# Altium project PanGu.PrjPcb
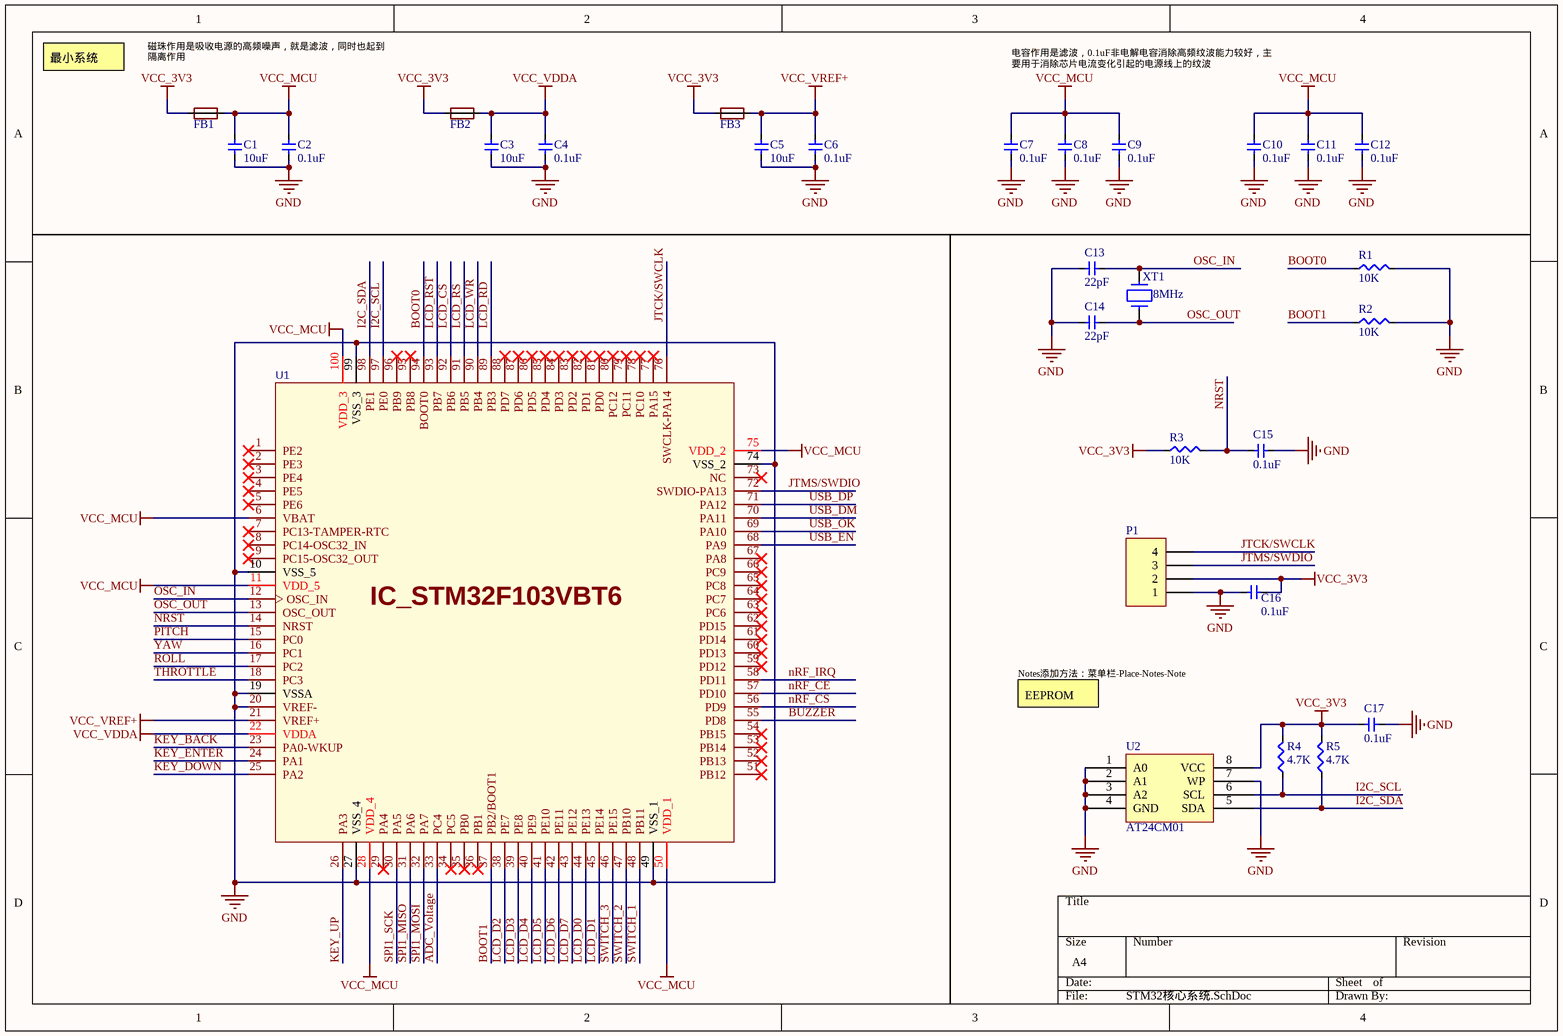
[diagram p0: STM32核心系统.SchDoc]
2 sheets, 86 parts. Net scope: global (net labels, ports and power ports of the same name join across sheets).
Board file: PanGu.PcbDoc
Sheets:
  STM32核心系统.SchDoc
  基本外设.SchDoc

## Sheet STM32核心系统.SchDoc
size A4

### Parts
C1  10uF  [C 0603_L]
C2  0.1uF  [C 0603_L]
C3  10uF  [C 0603_L]
C4  0.1uF  [C 0603_L]
C5  10uF  [C 0603_L]
C6  0.1uF  [C 0603_L]
C7  0.1uF  [C 0603_L]
C8  0.1uF  [C 0603_L]
C9  0.1uF  [C 0603_L]
C10  0.1uF  [C 0603_L]
C11  0.1uF  [C 0603_L]
C12  0.1uF  [C 0603_L]
C13  22pF  [C 0603_L]
C14  22pF  [C 0603_L]
C15  0.1uF  [C 0603_L]
C16  0.1uF  [C 0603_L]
C17  0.1uF  [C 0603_L]
FB1  FB_BEAD  [FB 0603_L]  (value not drawn)
FB2  FB_BEAD  [FB 0603_L]  (value not drawn)
FB3  FB_BEAD  [FB 0603_L]  (value not drawn)
P1  Header 4  [XH2.54-WI-4P]  (value not drawn)
R1  10K  [R 0603_L]
R2  10K  [R 0603_L]
R3  10K  [R 0603_L]
R4  4.7K  [R 0603_L]
R5  4.7K  [R 0603_L]
U1  IC_STM32F103VBT6  [LQFP100 14x14_M]
U2  AT24CM01  [SOIC-8]
XT1  value 8MHz  [OSC 5032-2P]  (hidden comment: XT_CRYSTAL2P)

### Nets
GND: C1.2 C2.2 C3.2 C4.2 C5.2 C6.2 C7.2 C8.2 C9.2 C10.2 C11.2 C12.2 C13.1 C14.1 C15.2 C16.1 C17.2 P1.1 R1.2 R2.2 U1.10(VSS_5) U1.19(VSSA) U1.20(VREF-) U1.27(VSS_4) U1.49(VSS_1) U1.74(VSS_2) U1.99(VSS_3) U2.1(A0) U2.2(A1) U2.3(A2) U2.4(GND) U2.7(WP)
VCC_3V3: C16.2 C17.1 FB1.2 FB2.2 FB3.2 P1.2 R3.1 R4.2 R5.2 U2.8(VCC)
VCC_MCU: C1.1 C2.1 C7.1 C8.1 C9.1 C10.1 C11.1 C12.1 FB1.1 U1.6(VBAT) U1.11(VDD_5) U1.28(VDD_4) U1.50(VDD_1) U1.75(VDD_2) U1.100(VDD_3)
VCC_VDDA: C3.1 C4.1 FB2.1 U1.22(VDDA)
VCC_VREF+: C5.1 C6.1 FB3.1 U1.21(VREF+)
ADC_Voltage: U1.33(PC4)
BOOT0: R1.1 U1.94(BOOT0)
BOOT1: R2.1 U1.37(PB2/BOOT1)
BUZZER: U1.55(PD8)
I2C_SCL: R4.1 U1.97(PE0) U2.6(SCL)
I2C_SDA: R5.1 U1.98(PE1) U2.5(SDA)
JTCK/SWCLK: P1.4 U1.76(SWCLK-PA14)
JTMS/SWDIO: P1.3 U1.72(SWDIO-PA13)
KEY_BACK: U1.23(PA0-WKUP)
KEY_DOWN: U1.25(PA2)
KEY_ENTER: U1.24(PA1)
KEY_UP: U1.26(PA3)
LCD_CS: U1.92(PB6)
LCD_D0: U1.44(PE13)
LCD_D1: U1.45(PE14)
LCD_D2: U1.38(PE7)
LCD_D3: U1.39(PE8)
LCD_D4: U1.40(PE9)
LCD_D5: U1.41(PE10)
LCD_D6: U1.42(PE11)
LCD_D7: U1.43(PE12)
LCD_RD: U1.89(PB3)
LCD_RS: U1.91(PB5)
LCD_RST: U1.93(PB7)
LCD_WR: U1.90(PB4)
nRF_CE: U1.57(PD10)
nRF_CS: U1.56(PD9)
nRF_IRQ: U1.58(PD11)
NRST: C15.1 R3.2 U1.14(NRST)
OSC_IN: C13.2 U1.12(OSC_IN) XT1.2
OSC_OUT: C14.2 U1.13(OSC_OUT) XT1.1
PITCH: U1.15(PC0)
ROLL: U1.17(PC2)
SPI1_MISO: U1.31(PA6)
SPI1_MOSI: U1.32(PA7)
SPI1_SCK: U1.30(PA5)
SWITCH_1: U1.48(PB11)
SWITCH_2: U1.47(PB10)
SWITCH_3: U1.46(PE15)
THROTTLE: U1.18(PC3)
USB_DM: U1.70(PA11)
USB_DP: U1.71(PA12)
USB_EN: U1.68(PA9)
USB_OK: U1.69(PA10)
YAW: U1.16(PC1)

Not connected (* = marked no-connect by the designer): U1 1(PE2)* 2(PE3)* 3(PE4)* 4(PE5)* 5(PE6)* 7(PC13-TAMPER-RTC)* 8(PC14-OSC32_IN)* 9(PC15-OSC32_OUT)* 29(PA4)* 34(PC5)* 35(PB0)* 36(PB1)* 51(PB12)* 52(PB13)* 53(PB14)* 54(PB15)* 59(PD12)* 60(PD13)* 61(PD14)* 62(PD15)* 63(PC6)* 64(PC7)* 65(PC8)* 66(PC9)* 67(PA8)* 73(NC)* 77(PA15)* 78(PC10)* 79(PC11)* 80(PC12)* 81(PD0)* 82(PD1)* 83(PD2)* 84(PD3)* 85(PD4)* 86(PD5)* 87(PD6)* 88(PD7)* 95(PB8)* 96(PB9)*

### Notes on the sheet
- 最小系统
- 磁珠作用是吸收电源的高频噪声，就是滤波，同时也起到隔离作用
- 电容作用是滤波，0.1uF非电解电容消除高频纹波能力较好，主要用于消除芯片电流变化引起的电源线上的纹波
- Notes添加方法：菜单栏-Place-Notes-Note
- EEPROM

### Library data of the parts
C1-C17 = CX_CAP: 电容
FB1-FB3 = FB_BEAD: 磁珠
P1 = Header 4: Header, 4-Pin; LatestRevisionDate: 17-Jul-2002; LatestRevisionNote: Re-released for DXP Platform.; Publisher: Altium Limited
R1-R5 = RX_RES: 电阻
U1 = IC_STM32F103VBT6: STM32单片机; BOM_Manufacturer: ST; subpart_no: 2; tags: STM32; BOM_Supplier Part: C8314; BOM_Supplier: LCSC; BOM_Manufacturer Part: STM32F103VBT6; image: http://image.lceda.cn/szlcsc/C8314.jpg; spicePre: U
U2 = IC_AT24C02: 存储芯片
XT1 = XT_CRYSTAL2P: 2P晶振

## Sheet 基本外设.SchDoc
size A4
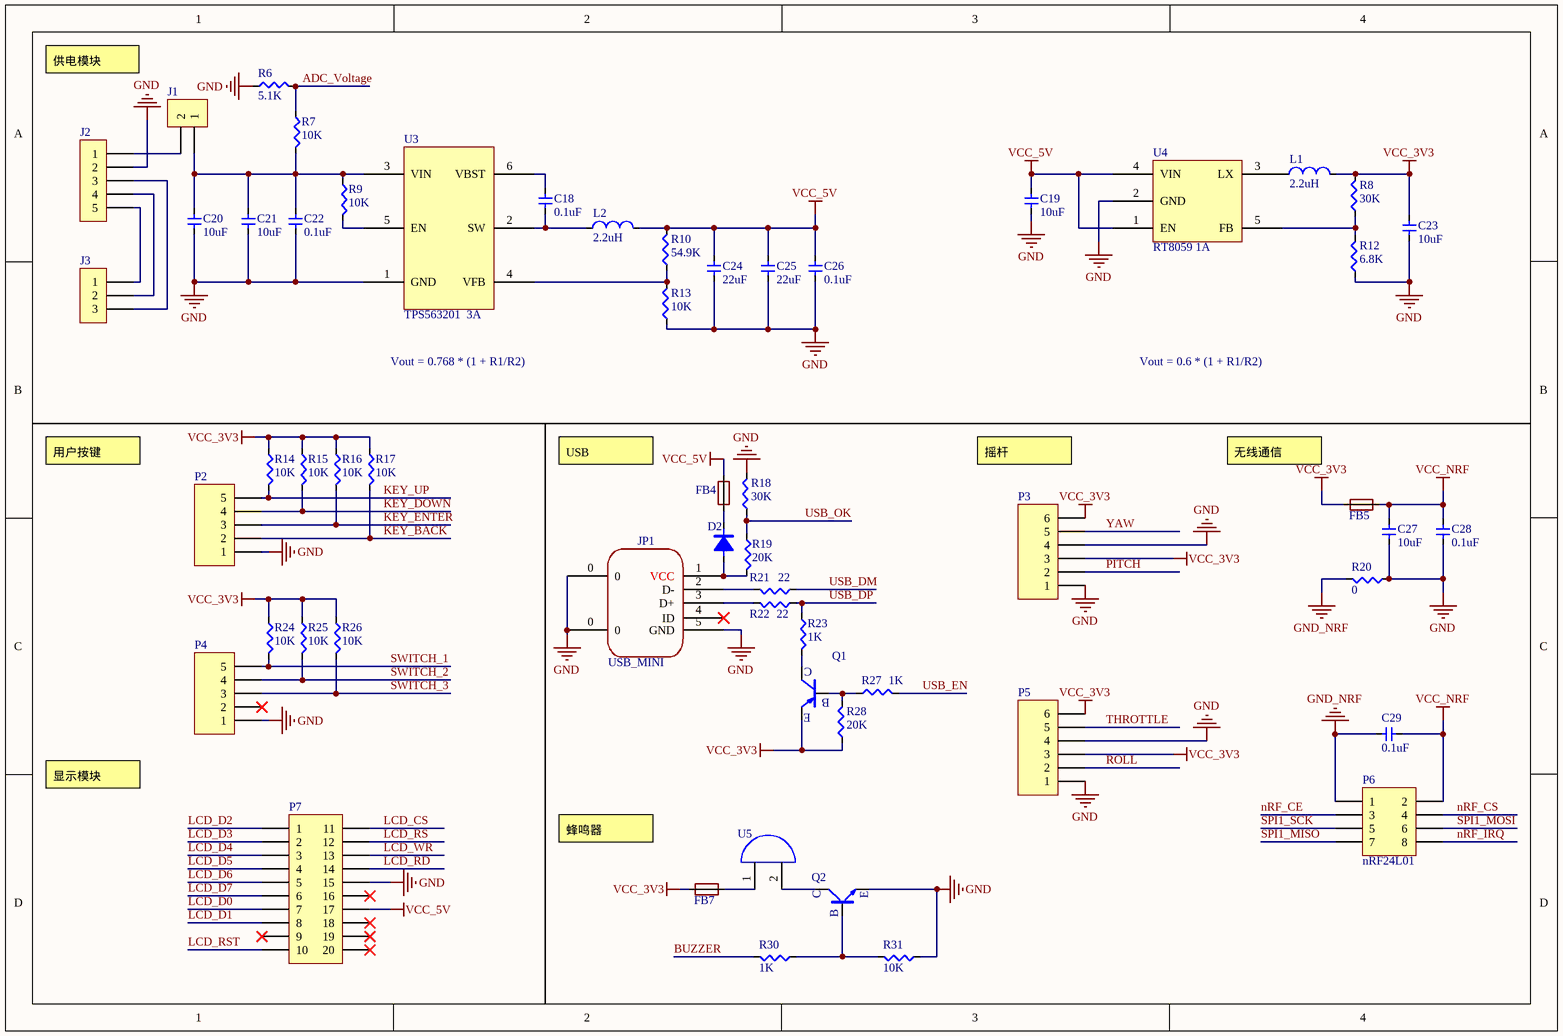
[diagram p1: 基本外设.SchDoc]

### Parts
C18  0.1uF  [C 0603_L]
C19  10uF  [C 0603_L]
C20  10uF  [C 0603_L]
C21  10uF  [C 0603_L]
C22  0.1uF  [C 0603_L]
C23  10uF  [C 0603_L]
C24  22uF  [C 0603_L]
C25  22uF  [C 0603_L]
C26  0.1uF  [C 0603_L]
C27  10uF  [C 0603_L]
C28  0.1uF  [C 0603_L]
C29  0.1uF  [C 0603_L]
D2  DX_DIODE  [SMA]  (value not drawn)
FB4  FB_BEAD  [FB 0603_L]  (value not drawn)
FB5  FB_BEAD  [FB 0603_L]  (value not drawn)
FB7  FB_BEAD  [FB 0603_L]  (value not drawn)
J1  PT_CON2  [PH2.0-WI-2P]  (value not drawn)
J2  PT_CON5  [PH2.0-WI-5P]  (value not drawn)
J3  (no value)  [PH2.0-WI-3P]
JP1  USB_MINI  [USB-MINI-5P-90度弯针]
L1  2.2uH  [L 2520]
L2  2.2uH  [L 2520]
P2  Header 5  [XH1.25-WS-5P]  (value not drawn)
P3  Header 6  [PH2.0-WS-6P]  (value not drawn)
P4  Header 6  [XH1.25-WS-5P]  (value not drawn)
P5  Header 6  [PH2.0-WS-6P]  (value not drawn)
P6  nRF24L01  [HDR2.54-2X4]
P7  Header 10X2A  [LCD_2.4_TFT]  (value not drawn)
Q1  TX_PNP  [SOT23-3L]  (value not drawn)
Q2  TX_NPN  [SOT23-3L]  (value not drawn)
R6  5.1K  [R 0603_L]
R7  10K  [R 0603_L]
R8  30K  [R 0603_L]
R9  10K  [R 0603_L]
R10  54.9K  [R 0603_L]
R12  6.8K  [R 0603_L]
R13  10K  [R 0603_L]
R14  10K  [R 0603_L]
R15  10K  [R 0603_L]
R16  10K  [R 0603_L]
R17  10K  [R 0603_L]
R18  30K  [R 0603_L]
R19  20K  [R 0603_L]
R20  0  [R 0603_L]
R21  22  [R 0603_L]
R22  22  [R 0603_L]
R23  1K  [R 0603_L]
R24  10K  [R 0603_L]
R25  10K  [R 0603_L]
R26  10K  [R 0603_L]
R27  1K  [R 0603_L]
R28  20K  [R 0603_L]
R30  1K  [R 0603_L]
R31  10K  [R 0603_L]
U3  TPS563201  3A  [SOT23-6L]
U4  RT8059 1A  [SOT23-5L]
U5  SC_BEEP  [SC_Buzzer]  (value not drawn)

### Nets
GND: C19.2 C20.2 C21.2 C22.2 C23.2 C24.2 C25.2 C26.2 C27.2 C28.2 J2.2 JP1.0 JP1.5(GND) P2.1 P3.1 P3.4 P4.1 P5.1 P5.4 P7.15 Q2.2 R6.1 R12.1 R13.1 R18.2 R20.1 R31.1 U3.1(GND) U4.2(GND)
GND_NRF: C29.1 P6.1 R20.2
VCC_3V3: C23.1 FB5.2 FB7.2 L1.2 P3.3 P3.6 P5.3 P5.6 Q1.2(E) R8.2 R14.1 R15.1 R16.1 R17.1 R24.1 R25.1 R26.1 R28.1
VCC_5V: C19.1 C24.1 C25.1 C26.1 FB4.2 L2.2 P7.17 R10.2 U4.1(EN) U4.4(VIN)
VCC_NRF: C27.1 C28.1 C29.2 FB5.1 P6.2
ADC_Voltage: R6.2 R7.1
BUZZER: R30.2
KEY_BACK: P2.2 R17.2
KEY_DOWN: P2.4 R15.2
KEY_ENTER: P2.3 R16.2
KEY_UP: P2.5 R14.2
LCD_CS: P7.11
LCD_D0: P7.7
LCD_D1: P7.8
LCD_D2: P7.1
LCD_D3: P7.2
LCD_D4: P7.3
LCD_D5: P7.4
LCD_D6: P7.5
LCD_D7: P7.6
LCD_RD: P7.14
LCD_RS: P7.12
LCD_RST: P7.10
LCD_WR: P7.13
nRF_CE: P6.3
nRF_CS: P6.4
nRF_IRQ: P6.8
PITCH: P3.2
ROLL: P5.2
SPI1_MISO: P6.7
SPI1_MOSI: P6.6
SPI1_SCK: P6.5
SWITCH_1: P4.5 R24.2
SWITCH_2: P4.4 R25.2
SWITCH_3: P4.3 R26.2
THROTTLE: P5.5
USB_DM: R21.1
USB_DP: R22.1 R23.1
USB_EN: R27.2
USB_OK: R18.1 R19.1
YAW: P3.5
NetC18_1: C18.1 U3.6(VBST)
NetC18_2: C18.2 L2.1 U3.2(SW)
NetC20_1: C20.1 C21.1 C22.1 J1.1 R7.2 R9.1 U3.3(VIN)
NetD2_1: D2.1(A) JP1.1(VCC) R19.2
NetD2_2: D2.2(K) FB4.1
NetFB7_1: FB7.1 U5.1
NetJ1_2: J1.2 J2.1
NetJ2_3: J2.3 J3.3
NetJ2_4: J2.4 J3.2
NetJ2_5: J2.5 J3.1
NetJP1_2: JP1.2(D-) R21.2
NetJP1_3: JP1.3(D+) R22.2
NetL1_1: L1.1 U4.3(LX)
NetQ1_1: Q1.1(B) R27.1 R28.2
NetQ1_3: Q1.3(C) R23.2
NetQ2_1: Q2.1 R30.1 R31.2
NetQ2_3: Q2.3 U5.2
NetR8_1: R8.1 R12.2 U4.5(FB)
NetR9_2: R9.2 U3.5(EN)
NetR10_1: R10.1 R13.2 U3.4(VFB)

Not connected (* = marked no-connect by the designer): JP1 4(ID)*; P4 2*; P7 9* 16* 18* 19* 20*

### Notes on the sheet
- 供电模块
- Vout = 0.768 * (1 + R1/R2)
- Vout = 0.6 * (1 + R1/R2)
- 用户按键
- USB
- 摇杆
- (near FB5) 无线通信
- 显示模块
- 蜂鸣器
- (in symbol TX_NPN) C; E; B

### Library data of the parts
C18-C29 = CX_CAP: 电容
D2 = DX_DIODE: 普通二极管
FB4 FB5 FB7 = FB_BEAD: 磁珠
J1 = PT_CON2: 接插件
J3 = PT_CON3
JP1 = PT_USB_MINI
L1 L2 = LX_INDUCTOR_1: 电感
P2 P4 = Header 5: Header, 5-Pin; LatestRevisionDate: 17-Jul-2002; LatestRevisionNote: Re-released for DXP Platform.; Publisher: Altium Limited
P3 P5 = Header 6: Header, 6-Pin; LatestRevisionDate: 17-Jul-2002; LatestRevisionNote: Re-released for DXP Platform.; Publisher: Altium Limited
P6 = Header 4X2: Header, 4-Pin, Dual row; LatestRevisionDate: 17-Jul-2002; LatestRevisionNote: Re-released for DXP Platform.; Publisher: Altium Limited
P7 = Header 10X2A: Header, 10-Pin, Dual row; LatestRevisionDate: 17-Jul-2002; LatestRevisionNote: Re-released for DXP Platform.; Publisher: Altium Limited
Q1 = TX_PNP: PNP三极管
Q2 = TX_NPN: NPN三极管
R6-R10 R12-R28 R30 R31 = RX_RES: 电阻
U3 = IC_DCDC_TPS563201: 稳压电源
U4 = IC_DCDC_RT8059: 稳压电源
U5 = SC_BEEP: 蜂鸣器

## Nets that join several sheets
GND: STM32核心系统 (32 pins), 基本外设 (29 pins)
VCC_3V3: STM32核心系统 (10 pins), 基本外设 (18 pins)
ADC_Voltage: STM32核心系统 (U1.33), 基本外设 (R6.2 R7.1)
BUZZER: STM32核心系统 (U1.55), 基本外设 (R30.2)
KEY_BACK: STM32核心系统 (U1.23), 基本外设 (P2.2 R17.2)
KEY_DOWN: STM32核心系统 (U1.25), 基本外设 (P2.4 R15.2)
KEY_ENTER: STM32核心系统 (U1.24), 基本外设 (P2.3 R16.2)
KEY_UP: STM32核心系统 (U1.26), 基本外设 (P2.5 R14.2)
LCD_CS: STM32核心系统 (U1.92), 基本外设 (P7.11)
LCD_D0: STM32核心系统 (U1.44), 基本外设 (P7.7)
LCD_D1: STM32核心系统 (U1.45), 基本外设 (P7.8)
LCD_D2: STM32核心系统 (U1.38), 基本外设 (P7.1)
LCD_D3: STM32核心系统 (U1.39), 基本外设 (P7.2)
LCD_D4: STM32核心系统 (U1.40), 基本外设 (P7.3)
LCD_D5: STM32核心系统 (U1.41), 基本外设 (P7.4)
LCD_D6: STM32核心系统 (U1.42), 基本外设 (P7.5)
LCD_D7: STM32核心系统 (U1.43), 基本外设 (P7.6)
LCD_RD: STM32核心系统 (U1.89), 基本外设 (P7.14)
LCD_RS: STM32核心系统 (U1.91), 基本外设 (P7.12)
LCD_RST: STM32核心系统 (U1.93), 基本外设 (P7.10)
LCD_WR: STM32核心系统 (U1.90), 基本外设 (P7.13)
nRF_CE: STM32核心系统 (U1.57), 基本外设 (P6.3)
nRF_CS: STM32核心系统 (U1.56), 基本外设 (P6.4)
nRF_IRQ: STM32核心系统 (U1.58), 基本外设 (P6.8)
PITCH: STM32核心系统 (U1.15), 基本外设 (P3.2)
ROLL: STM32核心系统 (U1.17), 基本外设 (P5.2)
SPI1_MISO: STM32核心系统 (U1.31), 基本外设 (P6.7)
SPI1_MOSI: STM32核心系统 (U1.32), 基本外设 (P6.6)
SPI1_SCK: STM32核心系统 (U1.30), 基本外设 (P6.5)
SWITCH_1: STM32核心系统 (U1.48), 基本外设 (P4.5 R24.2)
SWITCH_2: STM32核心系统 (U1.47), 基本外设 (P4.4 R25.2)
SWITCH_3: STM32核心系统 (U1.46), 基本外设 (P4.3 R26.2)
THROTTLE: STM32核心系统 (U1.18), 基本外设 (P5.5)
USB_DM: STM32核心系统 (U1.70), 基本外设 (R21.1)
USB_DP: STM32核心系统 (U1.71), 基本外设 (R22.1 R23.1)
USB_EN: STM32核心系统 (U1.68), 基本外设 (R27.2)
USB_OK: STM32核心系统 (U1.69), 基本外设 (R18.1 R19.1)
YAW: STM32核心系统 (U1.16), 基本外设 (P3.5)